# EAGLE design Deadlock_Prevention_Circuit (EAGLE 9.6.2)
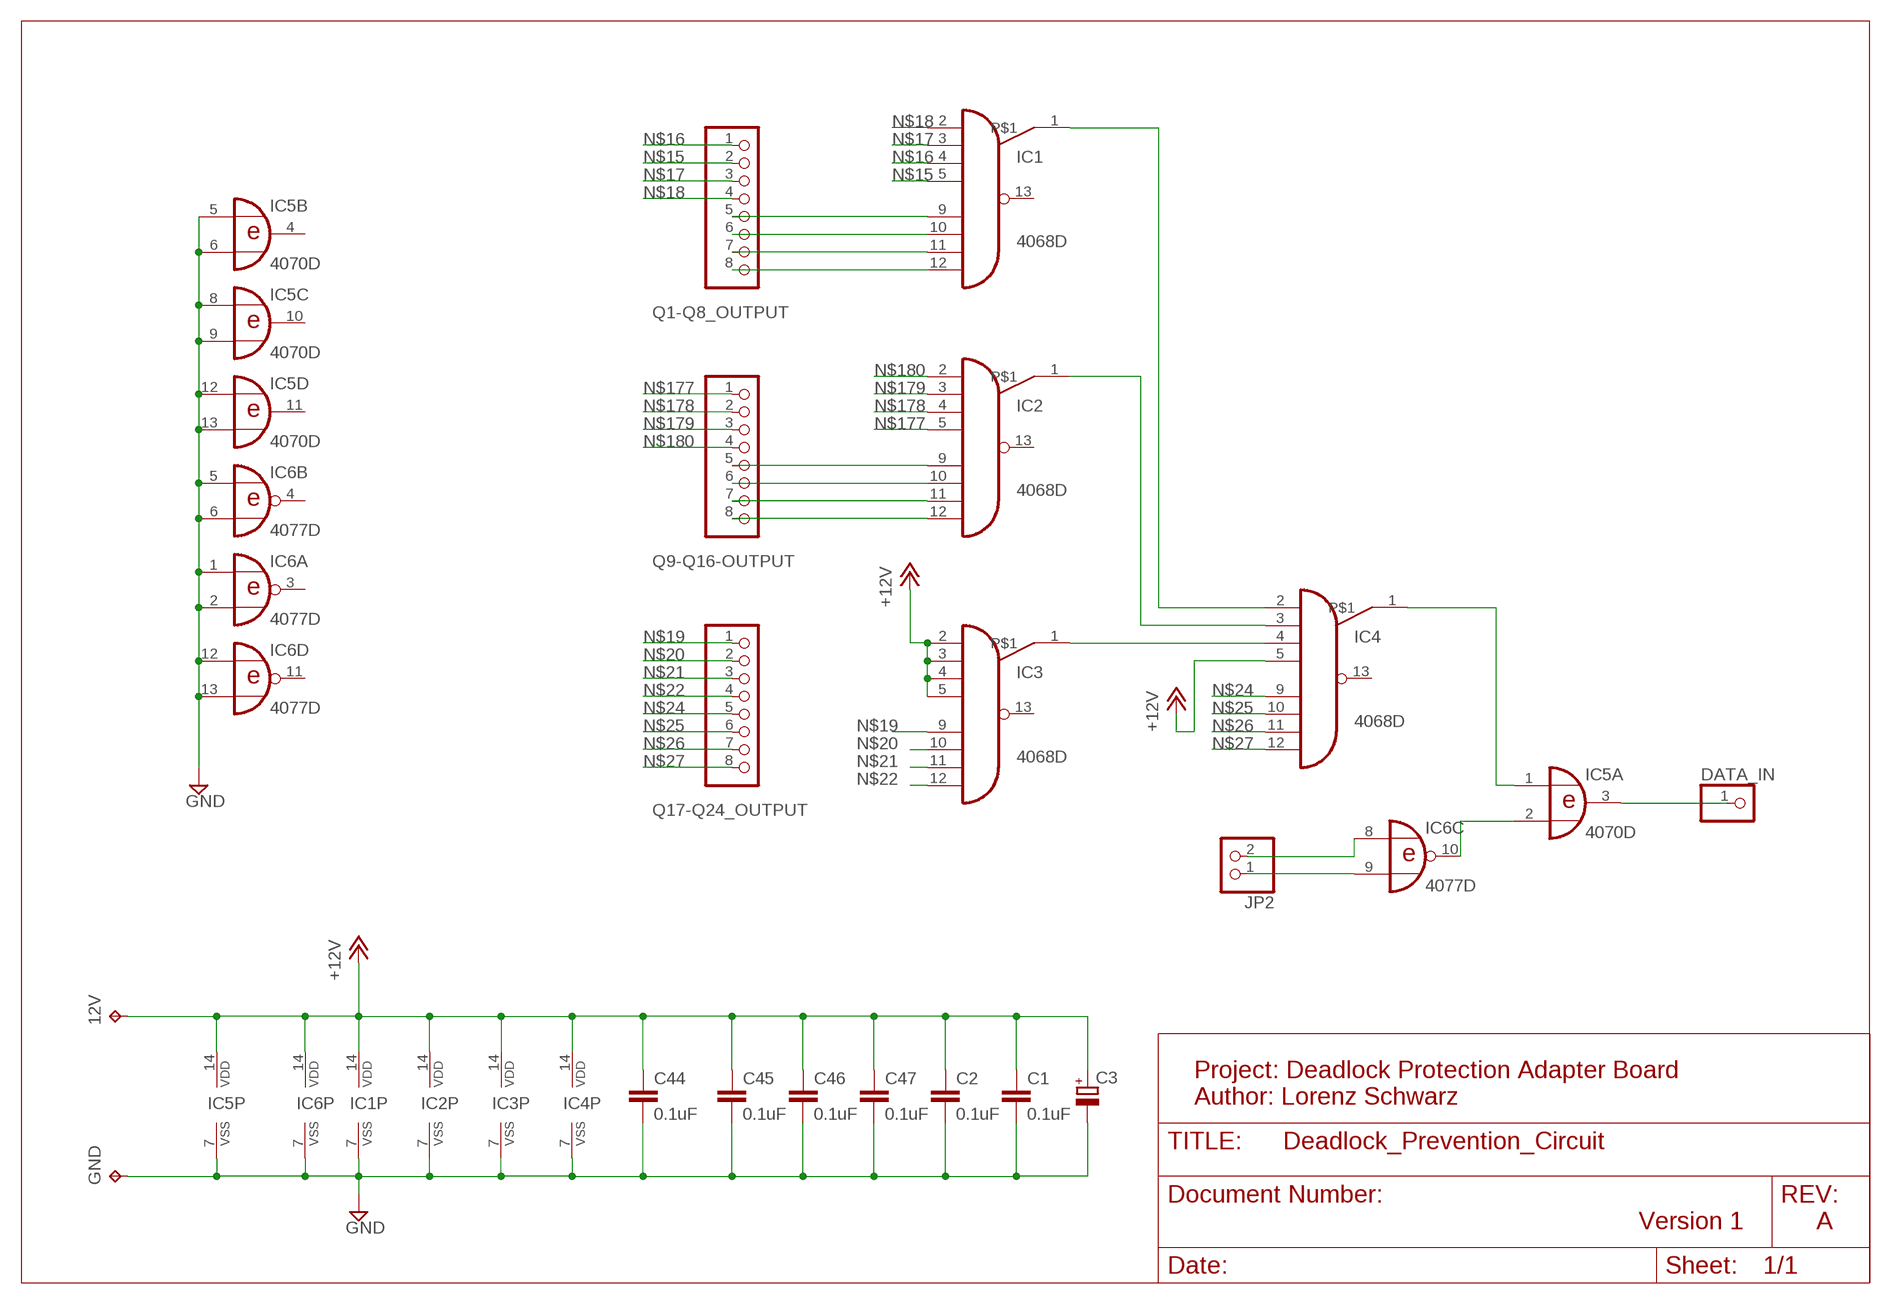
[diagram p0: schematic, sheet 1]

## Parts
12V  TPTP15SQ  [TP15SQ]
C1  0.1uF  C-EUC0805  [C0805]
C2  0.1uF  C-EUC0805  [C0805]
C3  CPOL-EUD  [PANASONIC_D]
C44  0.1uF  C-EUC0805  [C0805]
C45  0.1uF  C-EUC0805  [C0805]
C46  0.1uF  C-EUC0805  [C0805]
C47  0.1uF  C-EUC0805  [C0805]
DATA_IN  PINHD-1X1  [1X01]
GND  TPTP15SQ  [TP15SQ]
IC1  4068D  [SO14]
IC2  4068D  [SO14]
IC3  4068D  [SO14]
IC4  4068D  [SO14]
IC5  4070D  [SO14]
IC6  4077D  [SO14]
JP2  PINHD-1X2  [1X02]
Q1-Q8_OUTPUT  PINHD-1X8  [1X08]
Q9-Q16-OUTPUT  PINHD-1X8  [1X08]
Q17-Q24_OUTPUT  PINHD-1X8  [1X08]

## Nets
+12V: 12V.TP C1.1 C2.1 C3.+ C44.1 C45.1 C46.1 C47.1 IC1.14(VDD) IC2.14(VDD) IC3.2(I0) IC3.3(I1) IC3.4(I2) IC3.5(I3) IC3.14(VDD) IC4.5(I3) IC4.14(VDD) IC5.14(P:VDD) IC6.14(P:VDD)
GND: C1.2 C2.2 C3.- C44.2 C45.2 C46.2 C47.2 GND.TP IC1.7(VSS) IC2.7(VSS) IC3.7(VSS) IC4.7(VSS) IC5.5(B:I0) IC5.6(B:I1) IC5.7(P:VSS) IC5.8(C:I0) IC5.9(C:I1) IC5.12(D:I0) IC5.13(D:I1) IC6.1(A:I0) IC6.2(A:I1) IC6.5(B:I0) IC6.6(B:I1) IC6.7(P:VSS) IC6.12(D:I0) IC6.13(D:I1)
N$1: IC1.12(I7) Q1-Q8_OUTPUT.8
N$2: IC6.9(C:I1) JP2.1
N$3: IC1.1 IC4.2(I0)
N$4: IC2.1 IC4.3(I1)
N$5: IC3.1 IC4.4(I2)
N$6: IC6.8(C:I0) JP2.2
N$7: IC5.2(A:I1) IC6.10(C:O)
N$8: DATA_IN.1 IC5.3(A:O)
N$9: IC4.1 IC5.1(A:I0)
N$15: IC1.5(I3) Q1-Q8_OUTPUT.2
N$16: IC1.4(I2) Q1-Q8_OUTPUT.1
N$17: IC1.3(I1) Q1-Q8_OUTPUT.3
N$18: IC1.2(I0) Q1-Q8_OUTPUT.4
N$19: IC3.9(I4) Q17-Q24_OUTPUT.1
N$20: IC3.10(I5) Q17-Q24_OUTPUT.2
N$21: IC3.11(I6) Q17-Q24_OUTPUT.3
N$22: IC3.12(I7) Q17-Q24_OUTPUT.4
N$24: IC4.9(I4) Q17-Q24_OUTPUT.5
N$25: IC4.10(I5) Q17-Q24_OUTPUT.6
N$26: IC4.11(I6) Q17-Q24_OUTPUT.7
N$27: IC4.12(I7) Q17-Q24_OUTPUT.8
N$164: IC2.12(I7) Q9-Q16-OUTPUT.8
N$170: IC1.11(I6) Q1-Q8_OUTPUT.7
N$171: IC1.10(I5) Q1-Q8_OUTPUT.6
N$172: IC1.9(I4) Q1-Q8_OUTPUT.5
N$177: IC2.5(I3) Q9-Q16-OUTPUT.1
N$178: IC2.4(I2) Q9-Q16-OUTPUT.2
N$179: IC2.3(I1) Q9-Q16-OUTPUT.3
N$180: IC2.2(I0) Q9-Q16-OUTPUT.4
N$181: IC2.9(I4) Q9-Q16-OUTPUT.5
N$182: IC2.10(I5) Q9-Q16-OUTPUT.6
N$183: IC2.11(I6) Q9-Q16-OUTPUT.7
Unconnected: IC1.13(J) IC2.13(J) IC3.13(J) IC4.13(J) IC5.4(B:O) IC5.10(C:O) IC5.11(D:O) IC6.3(A:O) IC6.4(B:O) IC6.11(D:O)

## Notes on the sheet
- Project: Deadlock Protection Adapter Board
  Author: Lorenz Schwarz
- Version 1 | A

## Library data of the parts
12V GND = testpad:TP: Test pad
C1 C2 C44-C47 = rcl:C-EU: CAPACITOR, European symbol; SPICEPREFIX: C
C3 = rcl:CPOL-EU: POLARIZED CAPACITOR, European symbol; SPICEPREFIX: C
DATA_IN = pinhead01:PINHD-1X1: PIN HEADER
IC1-IC4 = 40xx_edit:4068: 8-input NAND
IC5 = 40xx:4070: Quad 2-input XOR
IC6 = 40xx:4077: Quad XNOR
JP2 = pinhead01:PINHD-1X2: PIN HEADER
Q1-Q8_OUTPUT Q9-Q16-OUTPUT Q17-Q24_OUTPUT = pinhead01:PINHD-1X8: PIN HEADER

## Board
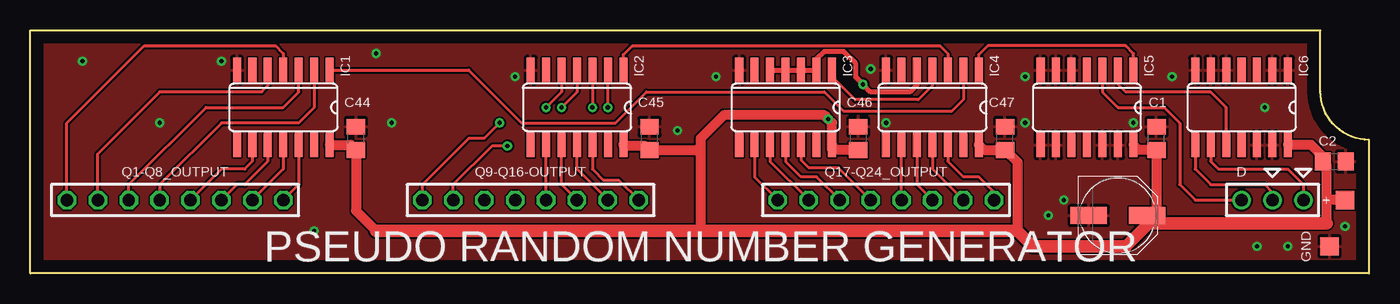
[diagram p1: board, top side]
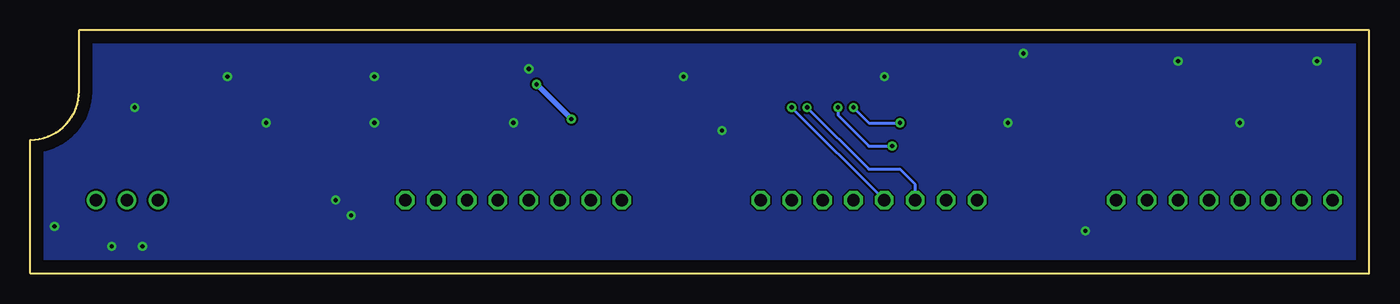
[diagram p2: board, bottom side, seen from below]

Size 110 x 20 mm. Coordinates in mm from the lower left corner, seen from the top.
Outline: 110,0 0,0 0,20 106,20 106,15 arc90 110,11 110,0
Copper layers (1*16): Top 0.035mm / dielectric 1.5mm / Bottom 0.035mm
Design rules "default": minimum track width 6mil, minimum drill 0.35mm, track to track 6mil, track to pad 6mil, pad to pad 6mil, via to via 6mil, smd to smd 6mil, copper to edge 40mil, drill to drill 6mil, minimum pad ring 10mil, minimum via ring 8mil, stop-mask expansion 4mil, vias tented up to drill 0mil, thermal gap 10mil

### Footprints (pad centres in the part's own frame; a part is rotated, then mirrored left to right if it is on the bottom)
TP15SQ = smd 1.5 x 1.5: TP 0,0
C0805 = smd 1.3 x 1.5: 1 -0.95,0; 2 0.95,0
PANASONIC_D = smd 3 x 1.4: + 2.4,0; - -2.4,0
1X01 = drill 1.016: 1 0,0
SO14 = smd 0.66 x 2.032: 1 -3.81,-3.073; 2 -2.54,-3.073; 3 -1.27,-3.073; 4 0,-3.073; 5 1.27,-3.073; 6 2.54,-3.073; 7 3.81,-3.073; 8 3.81,3.073; 9 2.54,3.073; 10 1.27,3.073; 11 0,3.073; 12 -1.27,3.073; 13 -2.54,3.073; 14 -3.81,3.073
1X02 = drill 1.016: 1 -1.27,0; 2 1.27,0
1X08 = drill 1.016 octagon: 1 -8.89,0; 2 -6.35,0; 3 -3.81,0; 4 -1.27,0; 5 1.27,0; 6 3.81,0; 7 6.35,0; 8 8.89,0

### Placement (x,y rotation side)
12V  108.03,6.04 0 top
C1  92.53,11.12 90 top
C2  107.14,9.22 0 top
C3  89.36,4.77 0 top
C44  26.75,11.12 90 top
C45  50.88,11.12 90 top
C46  68.02,11.12 90 top
C47  80.09,11.12 90 top
DATA_IN  99.52,6.04 0 top
GND  106.76,2.23 0 top
IC1  20.78,13.66 180 top
IC2  44.91,13.66 180 top
IC3  62.05,13.66 180 top
IC4  74.12,13.66 180 top
IC5  86.82,13.66 180 top
IC6  99.52,13.66 180 top
JP2  103.33,6.04 180 top
Q1-Q8_OUTPUT  11.89,6.04 0 top
Q9-Q16-OUTPUT  41.1,6.04 0 top
Q17-Q24_OUTPUT  70.31,6.04 0 top

### Tracks (layer width: path | path; a pad name or v marks a point on that pad's centre or on a via)
+12V  (via drill 0.35)
  Top 0.406: IC3.5 IC3.4 IC3.3 IC3.2 64.59,17.62 65.23,18.26 66.83,18.26 67.82,17.26 67.82,16.15 v68.41,15.56 69.04,14.93 72.26,14.93 72.85,15.52 IC4.5
  Top 0.813: 106.5,4.14 106.5,6.04 | 106.5,6.04 106.5,8.9 C2.1 106.19,9.63 105.23,10.59 IC6.14 | IC5.14 91.05,10.17 C1.1 92.53,4.77 91.9,4.14 | 81.11,3.5 81.11,9.15 C47.1 78.35,10.17 IC4.14 | C46.1 65.87,10.17 IC3.14 65.87,12.39 v65.55,12.71 65.23,13.03 56.98,13.03 55.07,11.12 55.07,9.85 | 55.07,9.85 55.07,3.5 | IC2.14 48.82,10.48 50.56,10.48 C45.1 54.75,10.17 55.07,9.85 | IC1.14 26.33,10.59 C44.1 26.75,5.15 28.4,3.5 | 12V.TP 106.5,6.04
  Top 1.016: 28.4,3.5 55.07,3.5 81.11,3.5 82.38,2.23 90,2.23 91.9,4.14 | 106.5,4.14 91.9,4.14 | 91.9,4.14 91.76,4.28 C3.+
  Bottom 0.406: v65.55,12.71 v68.41,15.56
GND  (via drill 0.35)
  other vias: 53.16,11.75 81.74,12.39 29.67,12.39 101.42,13.66 70.31,12.39 15.7,17.47 39.83,16.2 56.34,16.2 69.04,16.83 81.74,16.2 93.81,16.2 90.63,12.39 83.64,4.77 84.92,6.04 108.03,3.88 103.33,2.23 100.79,2.23 23.32,3.5 10.62,12.39 4.27,17.47 28.4,18.11
  pour Top: -0.81,20.01 109.68,20.01 109.68,-0.31 -0.81,-0.31
  pour Bottom: -0.81,20.01 109.68,20.01 109.68,-0.31 -0.81,-0.31
N$1
  Top 0.254: Q1-Q8_OUTPUT.8 22.05,7.31 IC1.12
N$2
  Top 0.254: IC6.9 96.98,9.22 97.61,8.58 103.33,8.58 104.6,7.31 JP2.1
N$3
  Top 0.254: IC1.1 36.02,16.73 40.36,12.39 48.09,12.39 50.62,14.93 65.23,14.93 66.82,13.34 75.71,13.34 76.66,14.3 IC4.2
N$4
  Top 0.254: IC2.1 48.72,18 49.46,18.74 74.75,18.74 75.39,18.11 IC4.3
N$5
  Top 0.254: IC3.1 65.87,16.2 67.77,14.3 72.95,14.3 74.12,15.46 IC4.4
N$6
  Top 0.254: IC6.8 95.71,8.58 96.98,7.31 101.42,7.31 102.06,6.67 JP2.2
N$7
  Top 0.254: IC6.10 98.25,13.66 96.98,14.93 90,14.93 89.36,15.56 IC5.2
N$8
  Top 0.254: IC5.3 88.09,14.93 89.36,13.66 93.17,13.66 94.44,12.39 94.44,7.31 95.71,6.04 DATA_IN.1
N$9
  Top 0.254: IC4.1 77.93,18 78.67,18.74 90,18.74 90.63,18.11 IC5.1
N$15
  Top 0.254: IC1.5 19.51,15.46 19,14.96 19.03,14.93 10.62,14.93 5.54,9.85 Q1-Q8_OUTPUT.2
N$16
  Top 0.254: Q1-Q8_OUTPUT.1 3,12.39 9.35,18.74 20.14,18.74 20.78,18.11 IC1.4
N$17
  Top 0.254: Q1-Q8_OUTPUT.3 8.08,7.31 14.43,13.66 20.78,13.66 22.05,14.93 IC1.3
N$18
  Top 0.254: IC1.2 23.32,13.66 22.05,12.39 15.7,12.39 10.62,7.31 Q1-Q8_OUTPUT.4
N$19
  Top 0.254: Q17-Q24_OUTPUT.1 59.52,7.94 IC3.9
N$20
  Top 0.254: Q17-Q24_OUTPUT.2 60.78,9.22 IC3.10
N$21
  Top 0.254: Q17-Q24_OUTPUT.3 64.59,7.94 63.33,7.94 62.05,9.22 IC3.11
N$22
  Top 0.254: Q17-Q24_OUTPUT.4 66.4,8.68 63.96,8.68 63.33,9.32 IC3.12
N$24
  Top 0.254: Q17-Q24_OUTPUT.5 IC4.9
N$25
  Top 0.254: Q17-Q24_OUTPUT.6 72.85,7.31 IC4.10
N$26
  Top 0.254: Q17-Q24_OUTPUT.7 74.12,8.58 IC4.11
N$27
  Top 0.254: Q17-Q24_OUTPUT.8 79.2,6.67 77.93,7.94 76.66,7.94 75.39,9.22 IC4.12
N$164
  Top 0.254: IC2.12 46.18,8.58 47.09,7.67 48.36,7.67 Q9-Q16-OUTPUT.8
N$170
  Top 0.254: Q1-Q8_OUTPUT.7 20.78,8.58 IC1.11
N$171
  Top 0.254: Q1-Q8_OUTPUT.6 16.97,7.31 17.61,7.31 19.51,9.22 IC1.10
N$172
  Top 0.254: IC1.9 18.24,9.22 17.61,8.58 15.7,8.58 Q1-Q8_OUTPUT.5
N$177  (via drill 0.35)
  Top 0.254: IC2.5 43.64,14.93 v42.37,13.66 | v38.56,12.39 37.29,11.12 36.02,11.12 32.21,7.31 Q9-Q16-OUTPUT.1
  Bottom 0.254: v42.37,13.66 41.1,12.39 v38.56,12.39
N$178  (via drill 0.35)
  Top 0.254: IC2.4 44.91,14.93 v43.64,13.66 | v39.2,10.48 37.92,10.48 34.75,7.31 Q9-Q16-OUTPUT.2
  Bottom 0.254: v39.2,10.48 41.1,10.48 43.64,13.03 v43.64,13.66
N$179  (via drill 0.35)
  Top 0.254: IC2.3 v46.18,13.66
  Bottom 0.254: v46.18,13.66 41.1,8.58 38.56,8.58 37.29,7.31 Q9-Q16-OUTPUT.3
N$180  (via drill 0.35)
  Top 0.254: v47.45,13.66 IC2.2
  Bottom 0.254: Q9-Q16-OUTPUT.4 v47.45,13.66
N$181
  Top 0.254: Q9-Q16-OUTPUT.5 IC2.9
N$182
  Top 0.254: Q9-Q16-OUTPUT.6 43.64,7.31 IC2.10
N$183
  Top 0.254: Q9-Q16-OUTPUT.7 44.91,8.58 IC2.11

### Text on the board
tNames: D | + | GND | PSEUDO RANDOM NUMBER GENERATOR